# EasyEDA schematic ESP_Server.json
TITLE: Sheet_1; REV: 1.0; Date: 2020-12-30; Sheet: 1/1; Company: Your Company
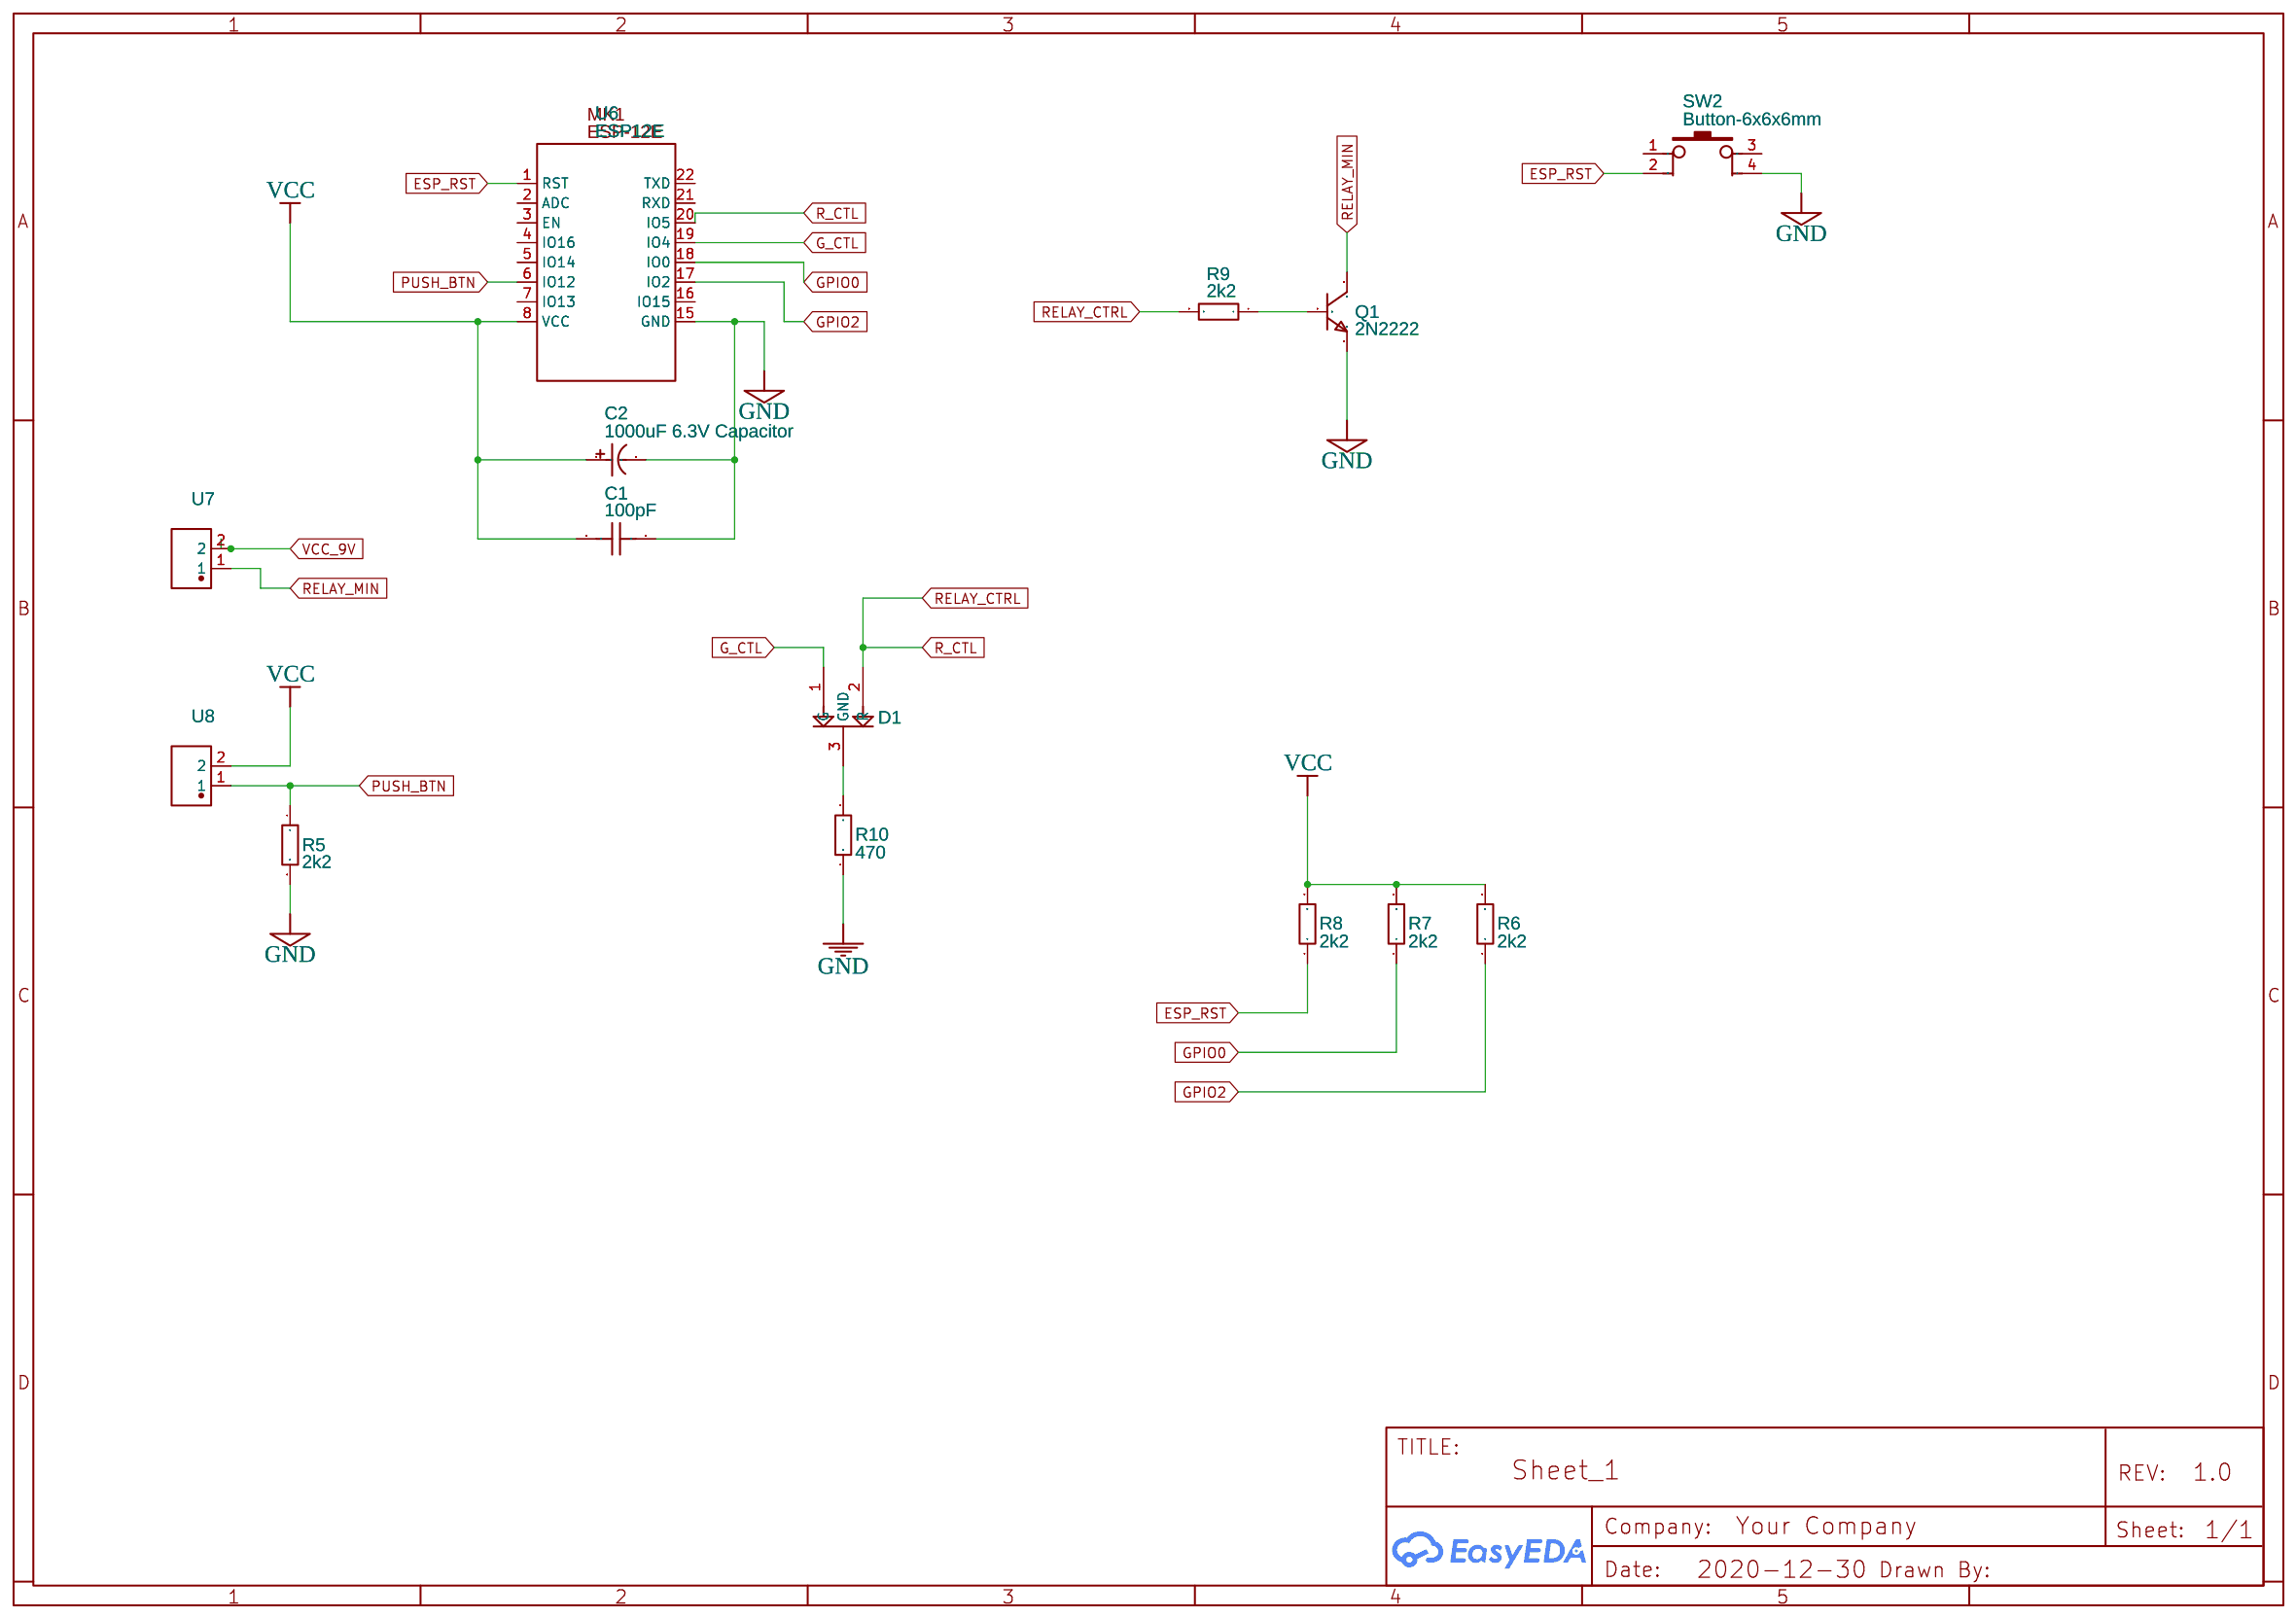
[diagram p0: schematic sheet]

## Parts
C1  100pF  [CAP-TH_L5.0-W2.5-P5.08-D0.7]
C2  1000uF 6.3V Capacitor  [1000UF 6.3V CAPACITOR]
D1  RED GREEN CATODO  [LED GREEN RED CATODO]
Q1  2N2222  [TO-92-3_L4.9-W3.7-P1.27-L]
R5  2k2  [AXIAL-0.5]
R6  2k2  [AXIAL-0.5]
R7  2k2  [AXIAL-0.5]
R8  2k2  [AXIAL-0.5]
R9  2k2  [AXIAL-0.5]
R10  470  [AXIAL-0.4]
SW2  Button-6x6x6mm  [SW-TH_4PIN-L6.00-W6.00]
U6  ESP12E  [ESP12E]
U7  XY301V-A-5.0-2P  [CONN-TH_XY301V-A-5.0-2P]
U8  XY301V-A-5.0-2P  [CONN-TH_XY301V-A-5.0-2P]

## Library data of the parts
C1 = CC1H101KC74DSL4B10MN: Supplier: LCSC; Supplier Part: C254079; Manufacturer: Dersonic; Contributor: LCSC
C2 = 1000uF 6.3V Capacitor: Contributor: l0_0t
D1 = RED GREEN CATODO: DIP LED Red/Green Common anode;; Manufacturer Part: RG309WK-C; sourceId: UPztnFzH3; Contributor: SCROSTH
Q1 = 2N2222: Supplier: LCSC; Manufacturer: SEMTECH; Contributor: LCSC; Supplier Part: C118536
R5-R9 = 2k2: Power: 1/2W; Tolerance: ±5%; EasyEDA: C69874; Supplier Part: C69874; Supplier: EasyEDA; Manufacturer Part: CFR02SJ0220A10
R10 = 47Ω: Supplier: LCSC; Manufacturer: UniOhm; Manufacturer Part: MFR0W4F4700A50; Supplier Part: C58592
SW2 = Button-6x6x6mm: Supplier Part: C71836; Supplier: LCSC; Manufacturer: BBJ; Manufacturer Part: Switch,6*6*6Plastic head,260G, 0.25mm,Straight line
U6 = ESP12E: Contributor: deepak.engg84
U7 U8 = XY301V-A-5.0-2P: Supplier: LCSC; Supplier Part: C557651; Manufacturer: --; Contributor: LCSC

## Nets
GND: C1.2 C2.2 Q1.1(E) R5.2 R10.1 SW2.4 U6.15(GND)
VCC: C1.1 C2.1 R6.2 R7.2 R8.2 U6.8(VCC) U8.2
VCC_9V: U7.2
ESP_RST: R8.1 SW2.2 U6.1(RST)
G_CTL: D1.1(G) U6.19(IO4)
GPIO0: R7.1 U6.18(IO0)
GPIO2: R6.1 U6.17(IO2)
PUSH_BTN: R5.1 U6.6(IO12) U8.1
RELAY_CTRL: D1.2(R) R9.2 U6.20(IO5)
RELAY_MIN: Q1.3(C) U7.1
Net-(D1-3): D1.3(GND) R10.2
Net-(Q1-2): Q1.2(B) R9.1

Not connected (* = marked no-connect by the designer): SW2 1 3; U6 2(ADC) 3(EN) 4(IO16) 5(IO14) 7(IO13) 16(IO15) 21(RXD) 22(TXD)
